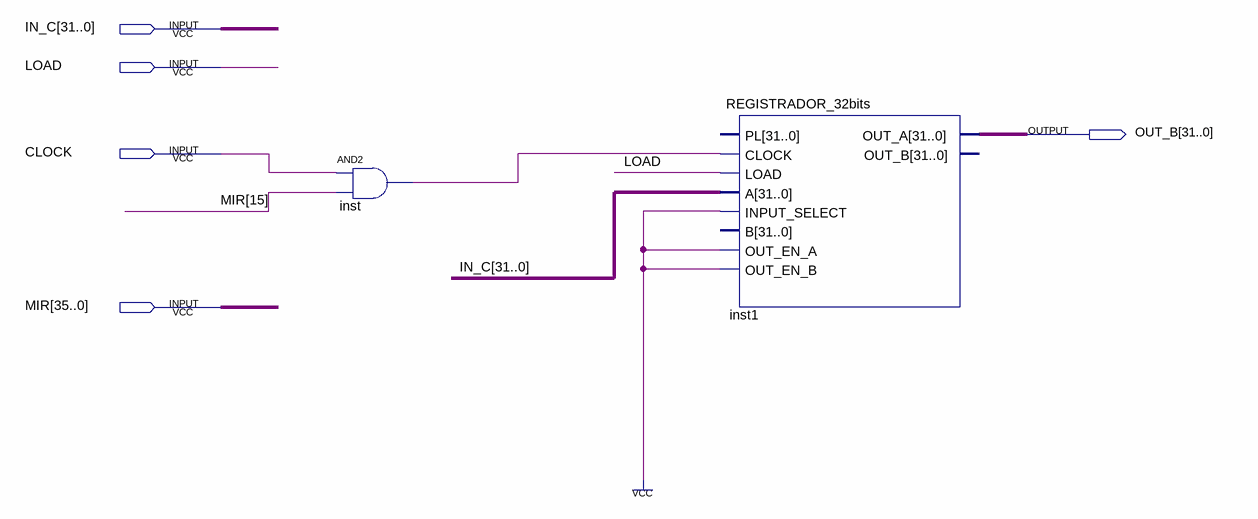
[diagram p0: schematic sheet]
// Quartus schematic H.bdf as structural Verilog: 2 symbols, 5 pins
module H (
  input  [31:0] IN_C,
  input  LOAD,
  input  CLOCK,
  input  [35:0] MIR,
  output [31:0] OUT_B
);

  wire inst_out;

  and inst (inst_out, CLOCK, MIR[15]);
  REGISTRADOR_32bits inst1 (
    .CLOCK(inst_out), .LOAD(LOAD), .A(IN_C), .INPUT_SELECT(1'b1), .OUT_EN_A(1'b1), .OUT_EN_B(1'b1),
    .OUT_A(OUT_B));  // open: PL, B, OUT_B
endmodule
